# Altium project PCB_Project1.PrjPCB
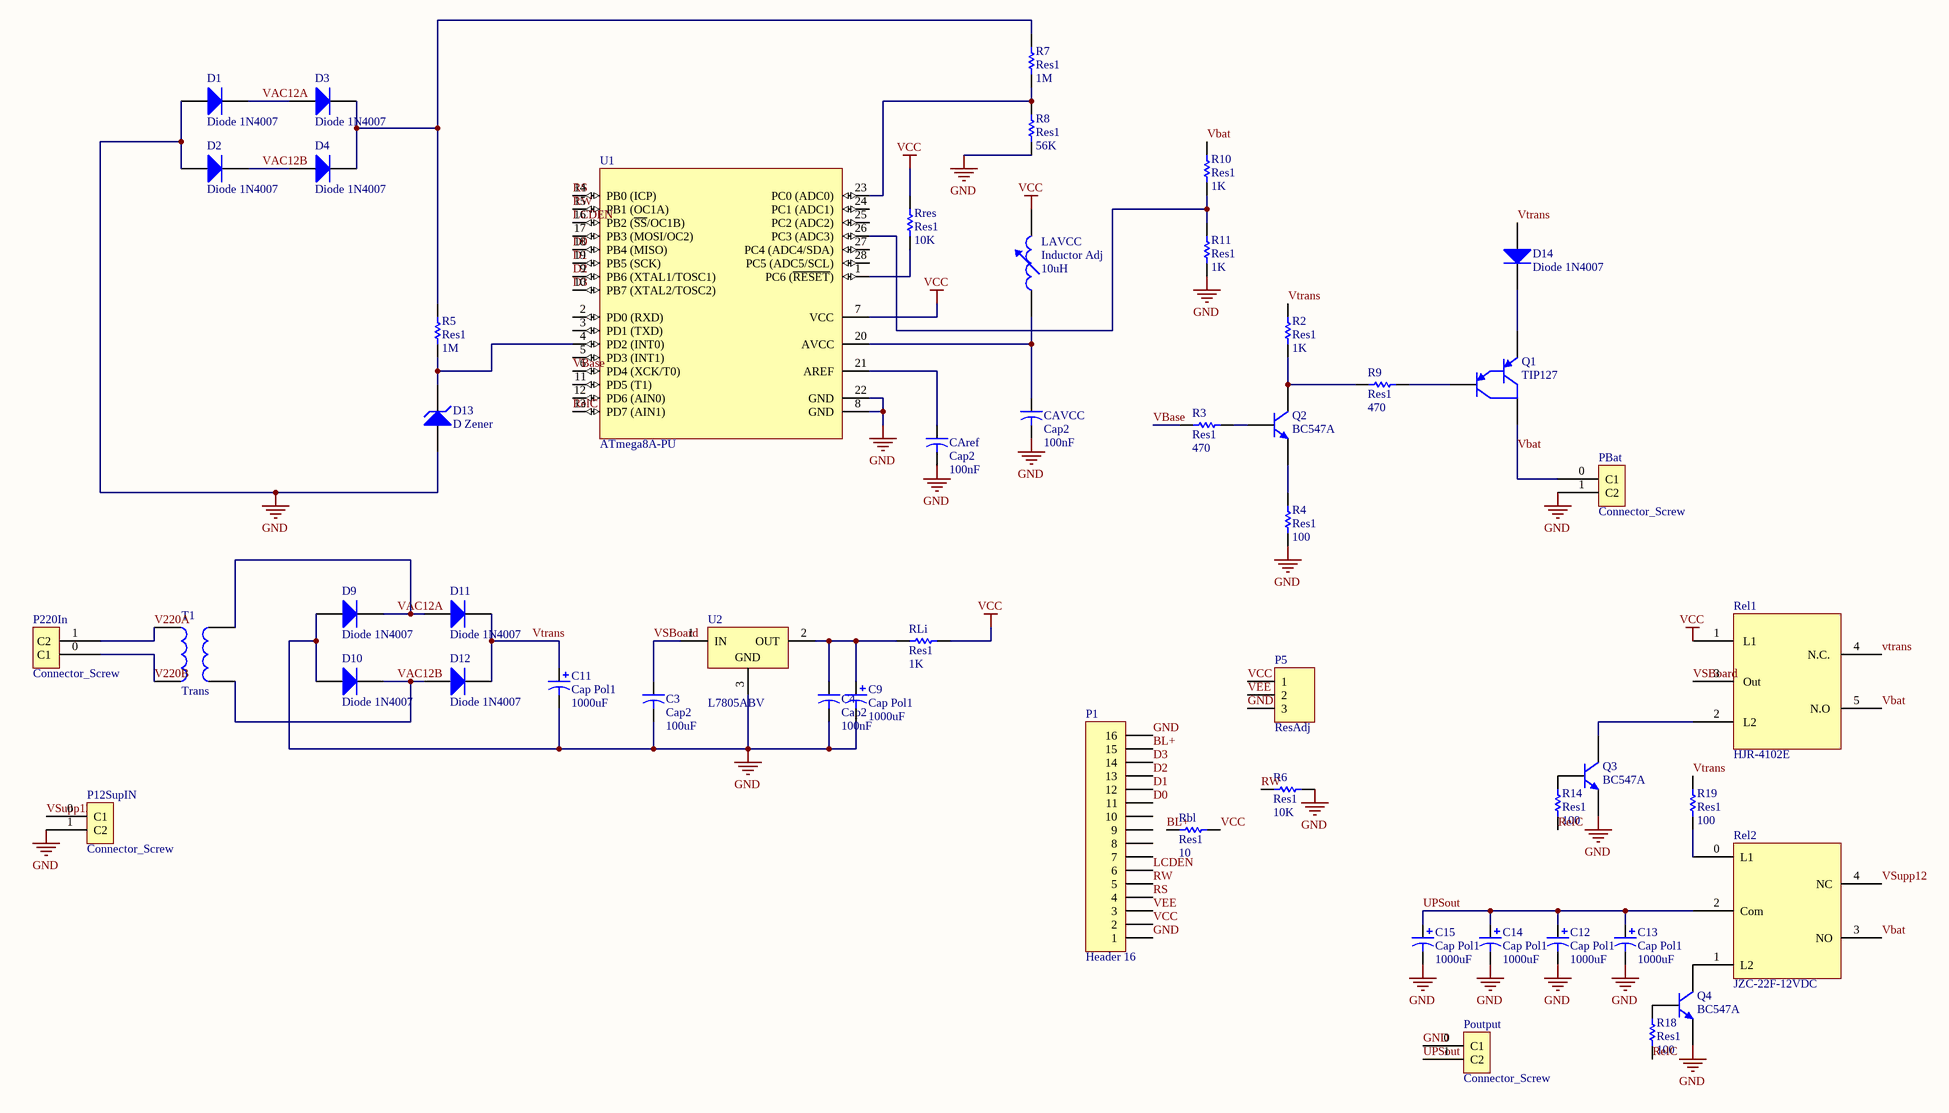
[diagram p0: Sheet1.SchDoc]
1 sheet, 52 parts. Net scope: global (net labels, ports and power ports of the same name join across sheets).
Board file: PCB1.PcbDoc

## Sheet Sheet1.SchDoc
size C

### Parts
C3  Cap2  value 100uF  [CAPR5-4X5]
C4  Cap2  value 100nF  [CAPR5-4X5]
C9  Cap Pol1  value 1000uF  [RB7.6-15]
C11  Cap Pol1  value 1000uF  [RB7.6-15]
C12  Cap Pol1  value 1000uF  [RB7.6-15]
C13  Cap Pol1  value 1000uF  [RB7.6-15]
C14  Cap Pol1  value 1000uF  [RB7.6-15]
C15  Cap Pol1  value 1000uF  [RB7.6-15]
CAref  Cap2  value 100nF  [CAPR5-4X5]
CAVCC  Cap2  value 100nF  [CAPR5-4X5]
D1  Diode 1N4007  [DO-41]
D2  Diode 1N4007  [DO-41]
D3  Diode 1N4007  [DO-41]
D4  Diode 1N4007  [DO-41]
D9  Diode 1N4007  [DO-41]
D10  Diode 1N4007  [DO-41]
D11  Diode 1N4007  [DO-41]
D12  Diode 1N4007  [DO-41]
D13  D Zener  [DIODE-0.4]
D14  Diode 1N4007  [DO-41]
LAVCC  Inductor Adj  value 10uH  [AXIAL-0.4]
P1  Header 16  [HDR1X16]
P5  ResAdj  [HDR1X3]
P12SupIN  Connector_Screw  [Screw Connector]
P220In  Connector_Screw  [Screw Connector]
PBat  Connector_Screw  [Screw Connector]
Poutput  Connector_Screw  [Screw Connector]
Q1  TIP127  [221A-02]
Q2  BC547A  [29-04]
Q3  BC547A  [29-04]
Q4  BC547A  [29-04]
R2  Res1  value 1K  [AXIAL-0.3]
R3  Res1  value 470  [AXIAL-0.3]
R4  Res1  value 100  [AXIAL-0.3]
R5  Res1  value 1M  [AXIAL-0.3]
R6  Res1  value 10K  [AXIAL-0.3]
R7  Res1  value 1M  [AXIAL-0.3]
R8  Res1  value 56K  [AXIAL-0.3]
R9  Res1  value 470  [AXIAL-0.3]
R10  Res1  value 1K  [AXIAL-0.3]
R11  Res1  value 1K  [AXIAL-0.3]
R14  Res1  value 100  [AXIAL-0.3]
R18  Res1  value 100  [AXIAL-0.3]
R19  Res1  value 100  [AXIAL-0.3]
Rbl  Res1  value 10  [AXIAL-0.3]
Rel1  HJR-4102E  [HJR-4102E]
Rel2  JZC-22F-12VDC  [JZC-22F-12VDC]
RLi  Res1  value 1K  [AXIAL-0.3]
Rres  Res1  value 10K  [AXIAL-0.3]
T1  Trans  [TRANS]
U1  ATmega8A-PU  [28P3]
U2  L7805ABV  [TO220ABN]

### Nets
GND: C3.2 C4.2 C9.2 C11.2 C12.2 C13.2 C14.2 C15.2 CAref.2 CAVCC.2 D1.1(A) D2.1(A) D9.1(A) D10.1(A) D13.1(A) P1.1 P1.16 P5.3 P12SupIN.1(C2) PBat.1(C2) Poutput.0(C1) Q3.3(E) Q4.3(E) R4.1 R6.2 R8.1 R11.1 U1.8(GND) U1.22(GND) U2.3(GND)
VCC: LAVCC.2 P1.2 P5.1 Rbl.2 Rel1.1(L1) RLi.2 Rres.2 U1.7(VCC)
BL+: P1.15 Rbl.1
D0: P1.11 U1.18(PB4_(MISO))
D1: P1.12 U1.19(PB5_(SCK))
D2: P1.13 U1.9(PB6_(XTAL1/TOSC1))
D3: P1.14 U1.10(PB7_(XTAL2/TOSC2))
LCDEN: P1.6 U1.16(PB2_(~{SS}/OC1B))
RelC: R14.1 R18.1 U1.13(PD7_(AIN1))
RS: P1.4 U1.14(PB0_(ICP))
RW: P1.5 R6.1 U1.15(PB1_(OC1A))
UPSout: C12.1 C13.1 C14.1 C15.1 Poutput.1(C2) Rel2.2(Com)
V220A: P220In.1(C2) T1.1
V220B: P220In.0(C1) T1.2
VAC12A: D1.2(K) D3.1(A) D9.2(K) D11.1(A) T1.4
VAC12B: D2.2(K) D4.1(A) D10.2(K) D12.1(A) T1.3
VBase: R3.1 U1.6(PD4_(XCK/T0))
Vbat: PBat.0(C1) Q1.2(C) R10.2 Rel1.5(N.O) Rel2.3(NO)
VEE: P1.3 P5.2
VSBoard: C3.1 Rel1.3(Out) U2.1(IN)
VSupp12: P12SupIN.0(C1) Rel2.4(NC)
Vtrans: C11.1 D11.2(K) D12.2(K) D14.1(A) R2.2 R19.2 Rel1.4(N.C.)
NetC4_1: C4.1 C9.1 RLi.1 U2.2(OUT)
NetCAref_1: CAref.1 U1.21(AREF)
NetCAVCC_1: CAVCC.1 LAVCC.1 U1.20(AVCC)
NetD3_2: D3.2(K) D4.2(K) R5.2 R7.2
NetD13_2: D13.2(K) R5.1 U1.4(PD2_(INT0))
NetD14_2: D14.2(K) Q1.3(E)
NetQ1_1: Q1.1(B) R9.2
NetQ2_1: Q2.1(C) R2.1 R9.1
NetQ2_2: Q2.2(B) R3.2
NetQ2_3: Q2.3(E) R4.2
NetQ3_1: Q3.1(C) Rel1.2(L2)
NetQ3_2: Q3.2(B) R14.2
NetQ4_1: Q4.1(C) Rel2.1(L2)
NetQ4_2: Q4.2(B) R18.2
NetR7_1: R7.1 R8.2 U1.23(PC0_(ADC0))
NetR10_1: R10.1 R11.2 U1.26(PC3_(ADC3))
NetR19_1: R19.1 Rel2.0(L1)
NetRres_1: Rres.1 U1.1(PC6_(~{RESET}))

Not connected (* = marked no-connect by the designer): P1 7 8 9 10; U1 2(PD0_(RXD)) 3(PD1_(TXD)) 5(PD3_(INT1)) 11(PD5_(T1)) 12(PD6_(AIN0)) 17(PB3_(MOSI/OC2)) 24(PC1_(ADC1)) 25(PC2_(ADC2)) 27(PC4_(ADC4/SDA)) 28(PC5_(ADC5/SCL))

### Library data of the parts
C3 C4 CAref CAVCC = Cap2: Capacitor; Published: 23-Sep-2002; PackageReference: CAPR5-4X5; Publisher: Altium Limited; PackageDescription: Capacitor; 2 Leads
C9 C11-C15 = Cap Pol1: Polarized Capacitor (Radial); Published: 8-Jun-2000; LatestRevisionDate: 17-Jul-2002; LatestRevisionNote: Re-released for DXP Platform.; PackageReference: RB7.6-15; Publisher: Altium Limited; PackageDescription: Polarized Capacitor (Radial); 2 Leads
D1-D4 D9-D12 D14 = Diode 1N4007: 1 Amp General Purpose Rectifier; Published: 8-Jun-2000; LatestRevisionDate: 17-Jul-2002; LatestRevisionNote: Re-released for DXP Platform.; DatasheetVersion: 1998; PackageVersion: Aug-1999; PackageReference: DO-41; Publisher: Altium Limited; PackageDescription: Diode, Axial; Body 5.2 x 2.7 mm (LxDia. max), Lead Dia. 0.86 mm (max); Code_JEDEC: DO-204-AL; ComponentLink1Description: Manufacturer Link; ComponentLink1URL: http://www.fairchildsemi.com/; ComponentLink2Description: Datasheet; ComponentLink2URL: http://www.fairchildsemi.com/ds/1N%2F1N4001.pdf
D13 = D Zener: Zener Diode; Published: 8-Jun-2000; LatestRevisionDate: 17-Jul-2002; LatestRevisionNote: Re-released for DXP Platform.; PackageReference: DIODE-0.5; Publisher: Altium Limited; PackageDescription: Diode, Thru-Hole; 2 Leads; 0.7 in Pin Spacing
LAVCC = Inductor Adj: Adjustable Inductor; Set Position: 0.5; Published: 24-Mar-1999; LatestRevisionDate: 17-Jul-2002; LatestRevisionNote: Re-released for DXP Platform.; PackageReference: AXIAL-0.4; Publisher: Altium Limited; PackageDescription: Axial Device, Thru-Hole; 2 Leads; 0.8 in Pin Spacing
P1 = Header 16: Header, 16-Pin; LatestRevisionDate: 17-Jul-2002; LatestRevisionNote: Re-released for DXP Platform.; Publisher: Altium Limited
P5 = Header 3: Header, 3-Pin; LatestRevisionDate: 17-Jul-2002; LatestRevisionNote: Re-released for DXP Platform.; Publisher: Altium Limited
P12SupIN P220In PBat Poutput = Connector_Screw: Screw Connector
Q1 = TIP127: Darlington Silicon Power PNP Transistor, 8 Amp, 100 Volts and 65 Watts; Note: Pin 2 is electrically connected to Pin 4 (TAB); Published: 19-Mar-2004; LatestRevisionDate: 06-Jun-2005; LatestRevisionNote: TAB pin 4 removed.; DatasheetVersion: 1984; PackageVersion: 1984; PackageReference: 221A-02; Publisher: Altium Limited; PackageDescription: TO, Thru-Hole, Vertical, Heatsink Mounted; 3 In-Line Leads; Pitch 2.54 mm; Code_JEDEC: TO-220-AB; ComponentLink1Description: Manufacturer Link; ComponentLink1URL: http://www.onsemi.com/site/products/landing?taxonomyID=194; ComponentLink2Description: Datasheet; ComponentLink2URL: http://www.onsemi.com/pub/Collateral/TIP120-D.PDF
Q2-Q4 = BC547A: Amplifier Transistor NPN Silicon; Published: 29-Sep-2000; LatestRevisionDate: 17-Jul-2002; LatestRevisionNote: Re-released for DXP Platform.; DatasheetVersion: 1991; PackageVersion: 1996; PackageReference: 29-04; Publisher: Altium Limited; PackageDescription: TO, Flat Index; 3 In-Line, Axial Leads; Body Dia. 4.8mm; Leads 0.48 x 0.5 mm (max); ComponentLink1Description: Manufacturer Link; ComponentLink1URL: http://www.onsemi.com/site/products/landing?taxonomyID=194; ComponentLink2Description: Datasheet; ComponentLink2URL: http://www.onsemi.com/pub/Collateral/BC546-D.PDF
R2-R11 R14 R18 R19 Rbl RLi Rres = Res1: Resistor; Published: 8-Jun-2000; LatestRevisionDate: 17-Jul-2002; LatestRevisionNote: Re-released for DXP Platform.; PackageReference: AXIAL-0.3; Publisher: Altium Limited; PackageDescription: Axial Device, Thru-Hole; 2 Leads; 0.3 in Pin Spacing
Rel1 = HJR-4102E: HJR-4102E 5V Relay
Rel2 = JZC-22F-12VDC: 12V 10A Relay
T1 = Trans: Transformer; Published: 24-Mar-1999; LatestRevisionDate: 08-Jul-2005; LatestRevisionNote: Mech Layer 1 removed.; PackageReference: TRANS; Publisher: Altium Limited; PackageDescription: Transformer; 4 Leads
U1 = ATmega8A-PU: 8-bit AVR Microcontroller, 8KB Flash, 512 Bytes EEPROM, 1KB SRAM, 28-pin PDIP, Industrial Grade (-40°C to 85°C); Published: 1-Apr-2010; DatasheetVersion: revC, Jul-2009; PackageVersion: revB, Sep-2001; PackageReference: 28P3; Publisher: Altium Limited; PackageDescription: 28-lead (0.300"/7.62mm Wide) Plastic Dual Inline Package (PDIP); Supplier 1: Digi-Key; Supplier Part Number 1: ATMEGA8A-PU-ND; Supplier 2: Farnell; Supplier Part Number 2: 1748534; Supplier 3: Mouser; Supplier Part Number 3: 556-ATMEGA8A-PU; ComponentLink1Description: Manufacturer Link; ComponentLink1URL: http://www.atmel.com/products/avr/default.asp?; ComponentLink2Description: ATmega8A Datasheet; ComponentLink2URL: http://www.atmel.com/dyn/resources/prod_documents/doc8159.pdf; ComponentLink3Description: ATmega8A Summary; ComponentLink3URL: http://www.atmel.com/dyn/resources/prod_documents/8159S.pdf; ComponentLink4Description: Atmel.com Home; ComponentLink4URL: http://www.atmel.com
U2 = L7805ABV: Precision 1A Regulator; Note: Tab is connected to pin 3 (GND).; Published: 24-Aug-2001; LatestRevisionDate: 17-Jul-2002; LatestRevisionNote: Re-released for DXP Platform.; DatasheetVersion: Nov-1999; PackageVersion: Jun-1998; PackageReference: TO220ABN; Publisher: Altium Limited; PackageDescription: TO, Thru-Hole, Vertical, Heatsink Mounted; 3 In-Line Leads; Pitch 2.54 mm; Pin sequence 1, 3, 2; ComponentLink1Description: Manufacturer Link; ComponentLink1URL: http://www.st.com/; ComponentLink2Description: Datasheet; ComponentLink2URL: http://www.st.com/stonline/products/literature/ds/2144/l7805ab.pdf